# Altium schematic sheet Schematic1.SchDoc
size A; SheetNumber: 1; SheetTotal: 1
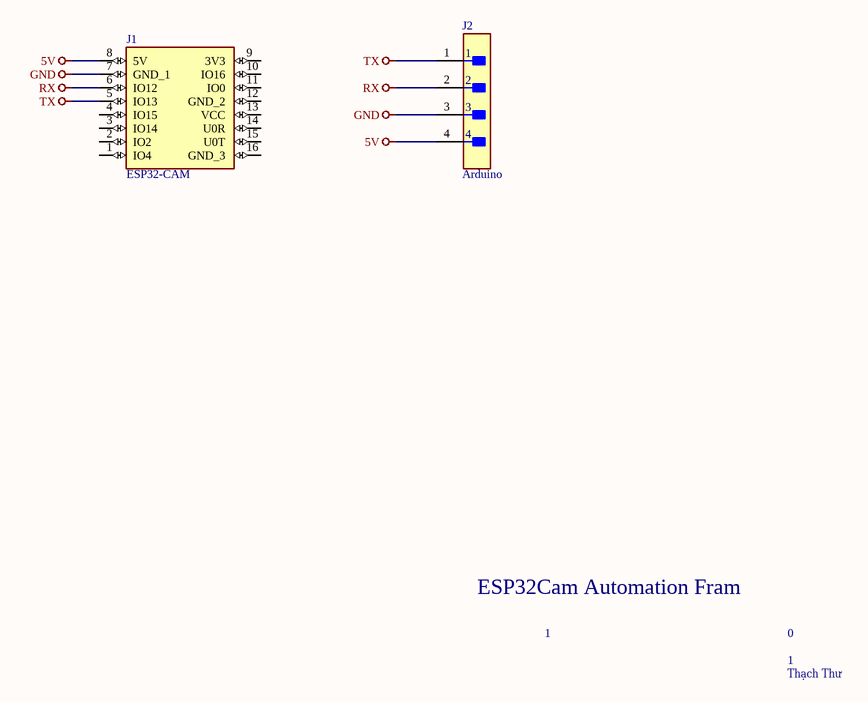
[diagram p0: Schematic1.SchDoc]

## Parts
J1  ESP32-CAM  [ESP32-CAM]
J2  Arduino  [FP-1881464-MFG]

## Nets
5V: J1.8(5V) J2.4
GND: J1.7(GND_1) J2.3
RX: J1.6(IO12) J2.2
TX: J1.5(IO13) J2.1

Not connected (* = marked no-connect by the designer): J1 1(IO4) 2(IO2) 3(IO14) 4(IO15) 9(3V3) 10(IO16) 11(IO0) 12(GND_2) 13(VCC) 14(U0R) 15(U0T) 16(GND_3)

## Notes on the sheet
- ESP32Cam Automation Fram
- 1
- 0
- Thạch Thư

## Library data of the parts
J1 = ESP32-CAM: ESP32 ESP32 Transceiver; 802.11 a/b/g/n (Wi-Fi, WiFi, WLAN), BluetoothÂ® Smart 4.x Low Energy (BLE) Evaluation Board; MF: AI-Thinker; Price: None; SnapEDA_Link: https://www.snapeda.com/parts/ESP32-CAM/AI-Thinker/view-part/?ref=snap; Check_prices: https://www.snapeda.com/parts/ESP32-CAM/AI-Thinker/view-part/?ref=eda; Package: None; Availability: Unavailable; Value: *; MP: ESP32-CAM
J2 = CMP-09399-000003-1: TERM BLOCK HDR 4POS 90DEG 2.5MM; Manufacturer Part Number: 1881464; Manufacturer: Phoenix Contact; Number Of Contacts: 4; Current Rating: 4A; Conn Orientation: Right Angle; Conn Gender: Male; Voltage Rating: 160V; ComponentLink2URL: https://www.phoenixcontact.com/online/portal/pi/?uri=pxc-oc-itemdetail:pid=1881464&library=pies&pcck=P-11-02-11&tab=1&selectedCategory=ALL; Height: 8.25mm; Automotive: No; Device Class L2: Headers and Wire Housings; ComponentLink2Description: Datasheet; Contact Material: Tin; Category: Conn; Octopart: https://octopart.com/1881464-phoenix+contact-62398; Device Class L3: unset; Pitch: 2.5mm; Lead Free: Yes; Device Class L1: Connectors; Digikey Description: TERM BLOCK HDR 4POS 90DEG 2.5MM; RoHS: TRUE; Package: 1881464; Number Of Rows: 1; Mouser Description: Conn; TermBlk; PCB; Header; SnglLvl; 90DegAngl; Sldr; 4Pole; 2.5mmPitch; COMBICON